# EAGLE design Tipper Remote Base Unit (EAGLE 9.6.2)
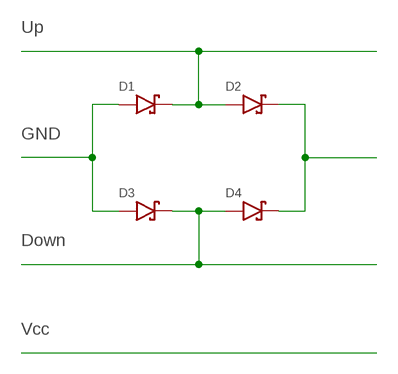
[diagram p0: schematic, sheet 1]

## Parts
D1  DIODE-SCHOTTKY-1N5822  [DIODE_SMB]
D2  DIODE-SCHOTTKY-1N5822  [DIODE_SMB]
D3  DIODE-SCHOTTKY-1N5822  [DIODE_SMB]
D4  DIODE-SCHOTTKY-1N5822  [DIODE_SMB]

## Nets
N$1: D1.C D2.A
N$2: D3.C D4.A
N$3: D1.A D3.A
N$4: D2.C D4.C

## Notes on the sheet
- Up
- GND
- Down
- Vcc

## Library data of the parts
D1-D4 = digitalconcepts:DIODE-SCHOTTKY-1N5822: 1N5822 Schottky Diode SMB

## Board
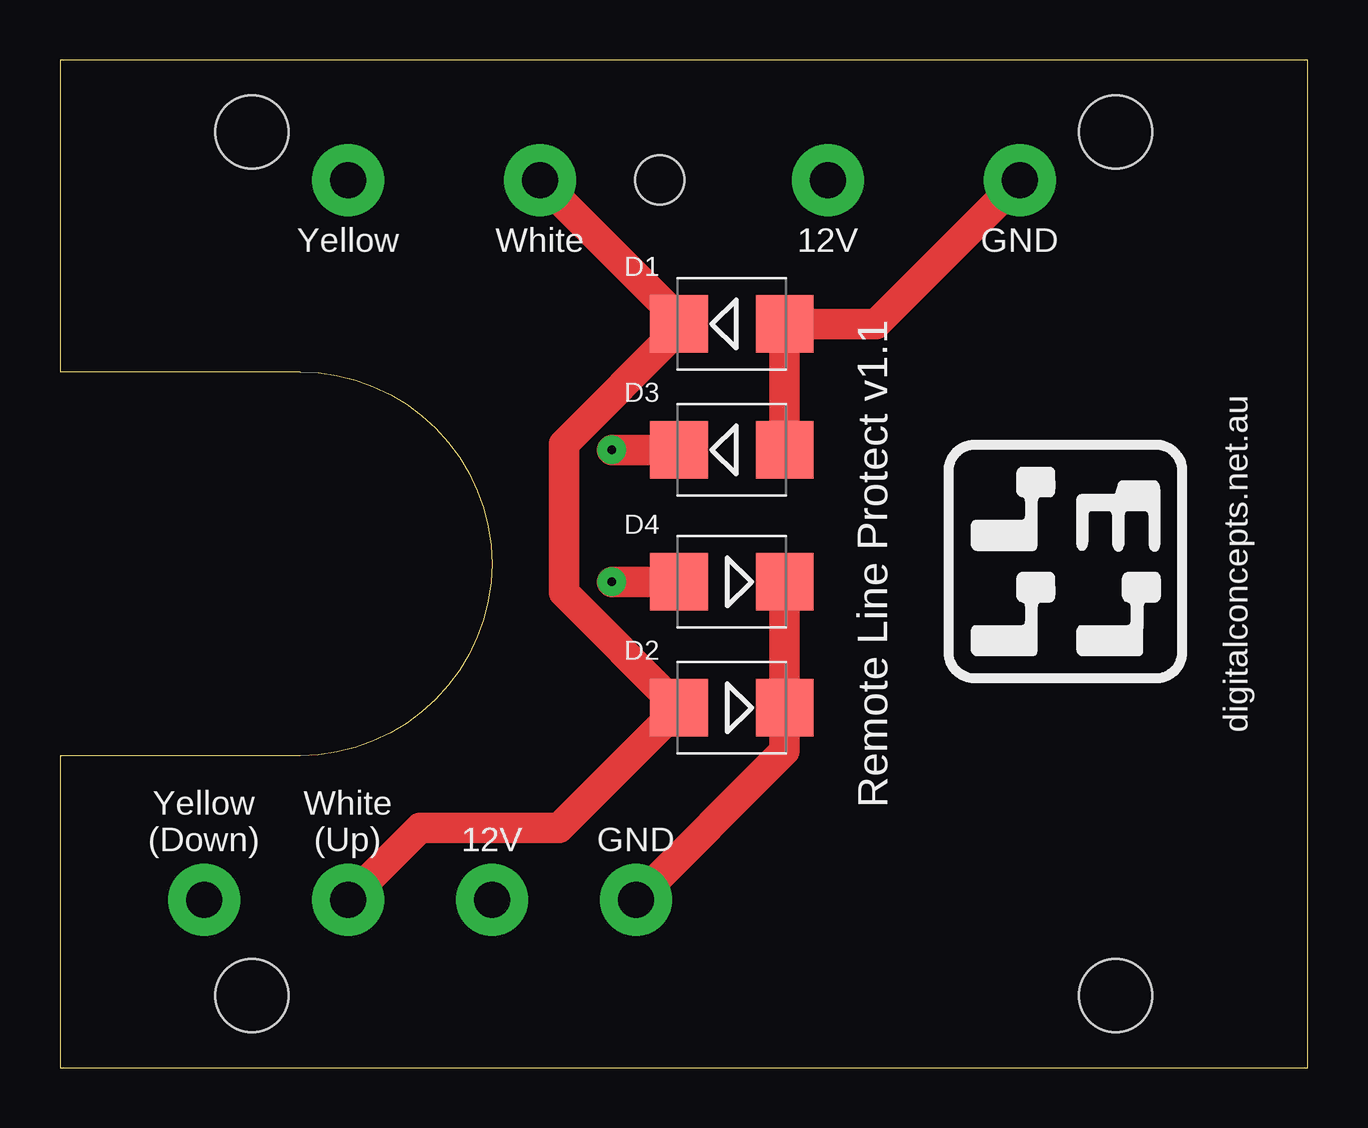
[diagram p1: board, top side]
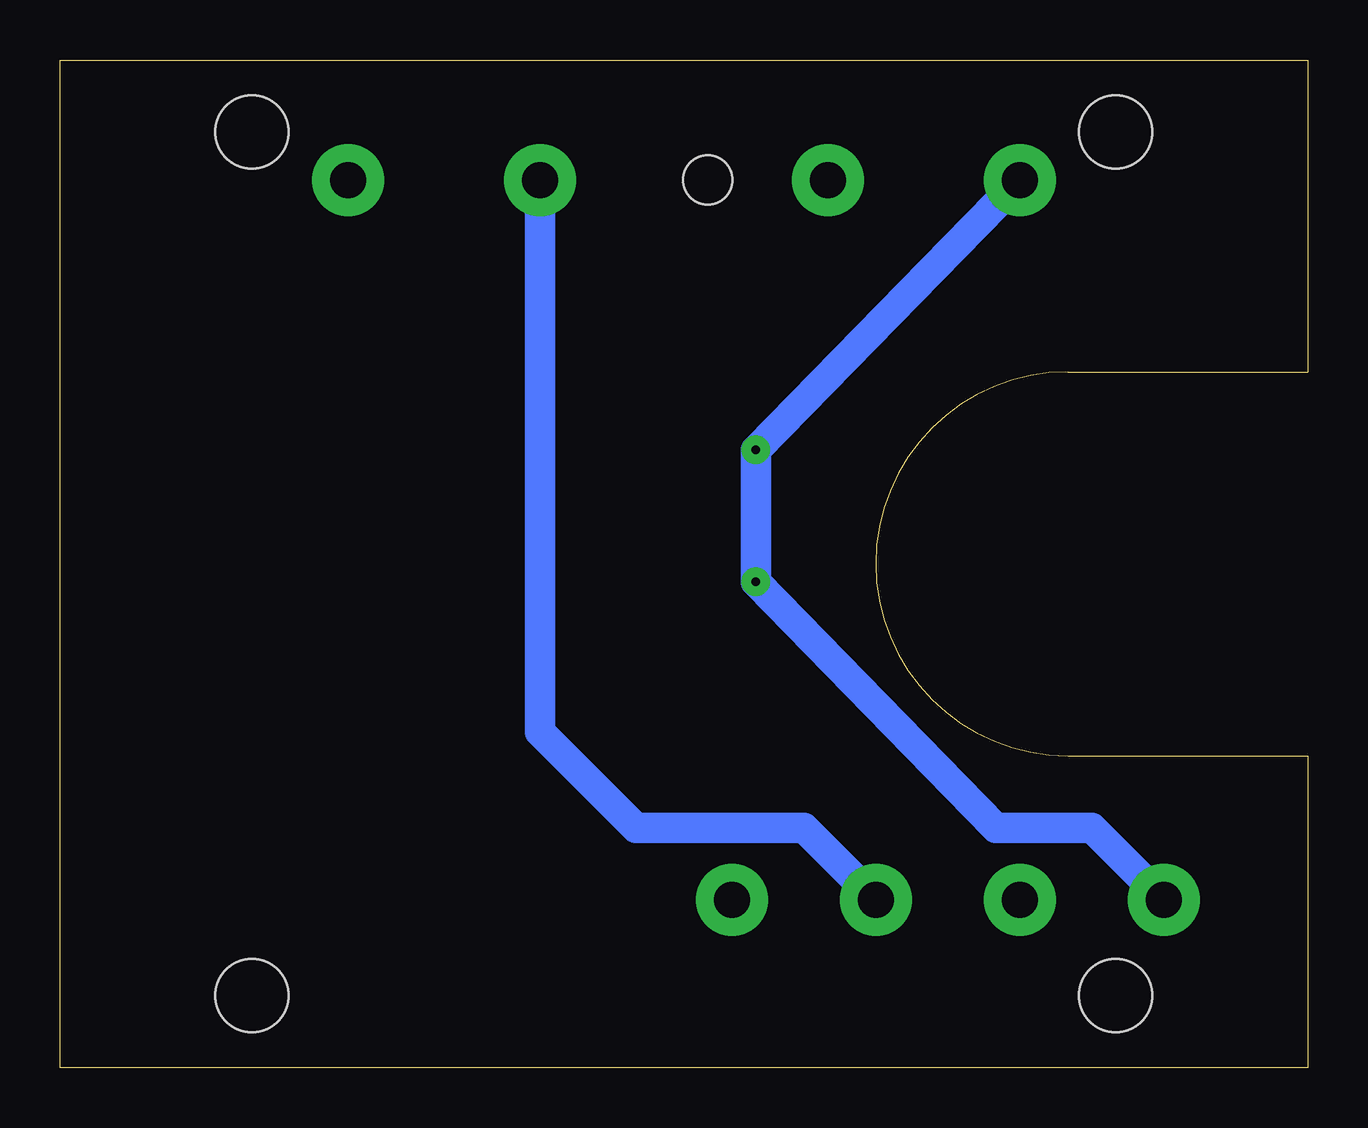
[diagram p2: board, bottom side, seen from below]

Size 52 x 42 mm. Coordinates in mm from the lower left corner, seen from the top.
Outline: 0,0 52,0 52,42 0,42 0,29 10,29 arc-180 10,13 0,13 0,0
Copper layers (1*16): Top 0.035mm / dielectric 1.5mm / Bottom 0.035mm
Design rules "default": minimum track width 6mil, minimum drill 0.35mm, track to track 6mil, track to pad 6mil, pad to pad 6mil, via to via 6mil, smd to smd 6mil, copper to edge 40mil, drill to drill 6mil, minimum pad ring 10mil, minimum via ring 8mil, stop-mask expansion 4mil, vias tented up to drill 0mil, thermal gap 10mil
Holes 2.03 mm at 25,37
Holes 3.05 mm at 44,39 44,3 8,3 8,39

### Footprints (pad centres in the part's own frame; a part is rotated, then mirrored left to right if it is on the bottom)
DIODE_SMB = smd 2.4 x 2.4: A 2.2,0; C -2.2,0

### Placement (x,y rotation side)
D1  28,31 0 top
D2  28,15 180 top
D3  28,25.75 0 top
D4  28,20.25 180 top

### Tracks (layer width: path | path; a pad name or v marks a point on that pad's centre or on a via)
N$1  (via drill 1.5 pad 3)
  Top 0.813: D1.C 25.8,31.2
  Top 1.27: D1.C 25.8,30.8 21,26 21,19.8 D2.A 20.8,10 15,10 v12,7 | 25.8,31.2 v20,37
N$2  (via drill 0.35 pad 1.2, 1.5 pad 3)
  Top 1.27: D4.A v23,20.25 | D3.C v23,25.75
  Bottom 1.27: v6,7 9,10 13,10 v23,20.25 v23,25.75 v12,37
N$3  (via drill 1.5 pad 3)
  Top 1.27: D3.A D1.A 34,31 v40,37
N$4  (via drill 1.5 pad 3)
  Top 1.27: D4.C D2.C 30.2,13.2 v24,7
N$6  (via drill 1.5 pad 3)
  Bottom 1.27: v32,37 32,14 28,10 21,10 v18,7

### Text on the board
tPlace: Remote Line Protect v1.1 | digitalconcepts.net.au
tNames: Yellow | White | 12V | GND | Yellow / (Down) | White / (Up) | 12V | GND